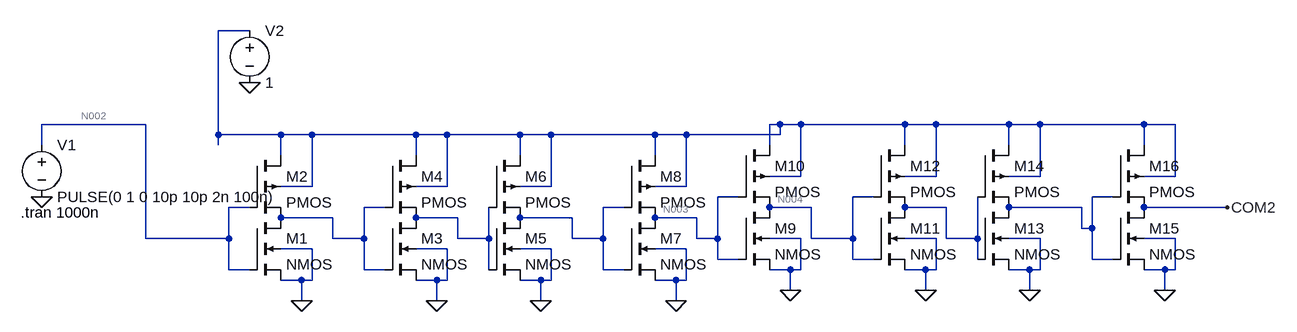
[diagram p0: schematic RingOscillator1.asc]
RingOscillator1.asc, the LTspice schematic file:
Version 4
SHEET 1 1828 680
WIRE 240 -112 192 -112
WIRE 80 32 -80 32
WIRE 1056 32 1040 32
WIRE 1088 32 1056 32
WIRE 1248 32 1088 32
WIRE 1296 32 1248 32
WIRE 1408 32 1296 32
WIRE 1456 32 1408 32
WIRE 1616 32 1456 32
WIRE 1664 32 1616 32
WIRE 192 48 192 -112
WIRE 288 48 192 48
WIRE 336 48 288 48
WIRE 496 48 336 48
WIRE 544 48 496 48
WIRE 656 48 544 48
WIRE 704 48 656 48
WIRE 864 48 704 48
WIRE 912 48 864 48
WIRE 1056 48 1056 32
WIRE 1056 48 912 48
WIRE -80 64 -80 32
WIRE 192 64 192 48
WIRE 1040 64 1040 32
WIRE 1248 64 1248 32
WIRE 1408 64 1408 32
WIRE 1616 64 1616 32
WIRE 288 80 288 48
WIRE 496 80 496 48
WIRE 656 80 656 48
WIRE 864 80 864 48
WIRE 1088 112 1088 32
WIRE 1088 112 1040 112
WIRE 1296 112 1296 32
WIRE 1296 112 1248 112
WIRE 1456 112 1456 32
WIRE 1456 112 1408 112
WIRE 1664 112 1664 32
WIRE 1664 112 1616 112
WIRE 336 128 336 48
WIRE 336 128 288 128
WIRE 544 128 544 48
WIRE 544 128 496 128
WIRE 704 128 704 48
WIRE 704 128 656 128
WIRE 912 128 912 48
WIRE 912 128 864 128
WIRE 992 144 960 144
WIRE 1200 144 1168 144
WIRE 1568 144 1536 144
WIRE 240 160 208 160
WIRE 448 160 416 160
WIRE 816 160 784 160
WIRE 1104 160 1040 160
WIRE 1312 160 1248 160
WIRE 1520 160 1408 160
WIRE 1744 160 1616 160
WIRE 368 176 288 176
WIRE 560 176 496 176
WIRE 736 176 656 176
WIRE 928 176 864 176
WIRE 1520 192 1520 160
WIRE 1536 192 1536 144
WIRE 1536 192 1520 192
WIRE 80 208 80 32
WIRE 208 208 208 160
WIRE 208 208 80 208
WIRE 368 208 368 176
WIRE 416 208 416 160
WIRE 416 208 368 208
WIRE 560 208 560 176
WIRE 608 208 608 160
WIRE 608 208 560 208
WIRE 736 208 736 176
WIRE 784 208 784 160
WIRE 784 208 736 208
WIRE 928 208 928 176
WIRE 960 208 960 144
WIRE 960 208 928 208
WIRE 1088 208 1040 208
WIRE 1104 208 1104 160
WIRE 1168 208 1168 144
WIRE 1168 208 1104 208
WIRE 1296 208 1248 208
WIRE 1312 208 1312 160
WIRE 1360 208 1360 144
WIRE 1360 208 1312 208
WIRE 1456 208 1408 208
WIRE 1664 208 1616 208
WIRE 336 224 288 224
WIRE 544 224 496 224
WIRE 704 224 656 224
WIRE 912 224 864 224
WIRE 960 240 960 208
WIRE 992 240 960 240
WIRE 1168 240 1168 208
WIRE 1200 240 1168 240
WIRE 1360 240 1360 208
WIRE 1536 240 1536 192
WIRE 1568 240 1536 240
WIRE 208 256 208 208
WIRE 240 256 208 256
WIRE 416 256 416 208
WIRE 448 256 416 256
WIRE 608 256 608 208
WIRE 784 256 784 208
WIRE 816 256 784 256
WIRE 1072 256 1040 256
WIRE 1088 256 1088 208
WIRE 1088 256 1072 256
WIRE 1280 256 1248 256
WIRE 1296 256 1296 208
WIRE 1296 256 1280 256
WIRE 1440 256 1408 256
WIRE 1456 256 1456 208
WIRE 1456 256 1440 256
WIRE 1648 256 1616 256
WIRE 1664 256 1664 208
WIRE 1664 256 1648 256
WIRE 320 272 288 272
WIRE 336 272 336 224
WIRE 336 272 320 272
WIRE 528 272 496 272
WIRE 544 272 544 224
WIRE 544 272 528 272
WIRE 688 272 656 272
WIRE 704 272 704 224
WIRE 704 272 688 272
WIRE 896 272 864 272
WIRE 912 272 912 224
WIRE 912 272 896 272
WIRE 1072 288 1072 256
WIRE 1280 288 1280 256
WIRE 1440 288 1440 256
WIRE 1648 288 1648 256
WIRE 320 304 320 272
WIRE 528 304 528 272
WIRE 688 304 688 272
WIRE 896 304 896 272
FLAG -80 144 0
FLAG 240 -32 0
FLAG 1744 160 COM2
FLAG 320 304 0
FLAG 528 304 0
FLAG 688 304 0
FLAG 896 304 0
FLAG 1072 288 0
FLAG 1280 288 0
FLAG 1440 288 0
FLAG 1648 288 0
SYMBOL voltage -80 48 R0
WINDOW 123 0 0 Left 0
WINDOW 39 0 0 Left 0
SYMATTR InstName V1
SYMATTR Value PULSE(0 1 0 10p 10p 2n 100n)
SYMBOL voltage 240 -128 R0
WINDOW 123 0 0 Left 0
WINDOW 39 0 0 Left 0
SYMATTR InstName V2
SYMATTR Value 1
SYMBOL nmos4 240 176 R0
SYMATTR InstName M1
SYMBOL pmos4 240 80 R0
SYMATTR InstName M2
SYMBOL nmos4 448 176 R0
SYMATTR InstName M3
SYMBOL pmos4 448 80 R0
SYMATTR InstName M4
SYMBOL nmos4 608 176 R0
SYMATTR InstName M5
SYMBOL pmos4 608 80 R0
SYMATTR InstName M6
SYMBOL nmos4 816 176 R0
SYMATTR InstName M7
SYMBOL pmos4 816 80 R0
SYMATTR InstName M8
SYMBOL nmos4 992 160 R0
SYMATTR InstName M9
SYMBOL pmos4 992 64 R0
SYMATTR InstName M10
SYMBOL nmos4 1200 160 R0
SYMATTR InstName M11
SYMBOL pmos4 1200 64 R0
SYMATTR InstName M12
SYMBOL nmos4 1360 160 R0
SYMATTR InstName M13
SYMBOL pmos4 1360 64 R0
SYMATTR InstName M14
SYMBOL nmos4 1568 160 R0
SYMATTR InstName M15
SYMBOL pmos4 1568 64 R0
SYMATTR InstName M16
TEXT -112 168 Left 2 !.tran 1000n

The netlist it stands for:
* RingOscillator1.asc
V1 N002 0 PULSE(0 1 0 10p 10p 2n 100n)
V2 N001 0 1
M1 N006 N002 0 0 NMOS
M2 N001 N002 N006 N001 PMOS
M3 N009 N006 0 0 NMOS
M4 N001 N006 N009 N001 PMOS
M5 N007 N009 0 0 NMOS
M6 N001 N009 N007 N001 PMOS
M7 N003 N007 0 0 NMOS
M8 N001 N007 N003 N001 PMOS
M9 N004 N003 0 0 NMOS
M10 N001 N003 N004 N001 PMOS
M11 N008 N004 0 0 NMOS
M12 N001 N004 N008 N001 PMOS
M13 N005 N008 0 0 NMOS
M14 N001 N008 N005 N001 PMOS
M15 COM2 N005 0 0 NMOS
M16 N001 N005 COM2 N001 PMOS
.model NMOS NMOS
.model PMOS PMOS
.lib standard.mos
.tran 1000n
.backanno
.end

* Results of the author's LTspice run, read from the files saved beside the schematic
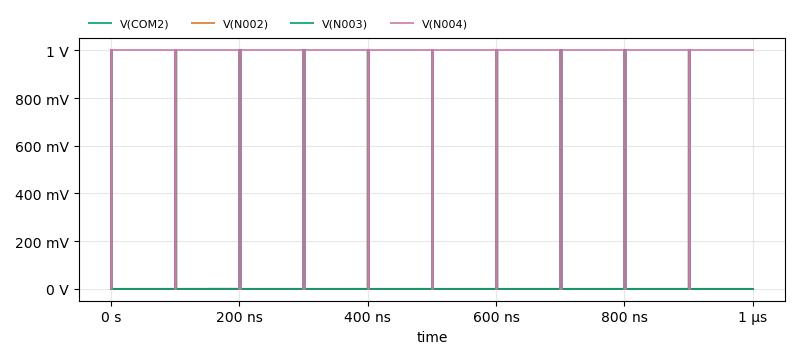
[diagram p1: Transient Analysis of RingOscillator1.asc, plotted from the saved traces]
* Transient Analysis, 1 run:
*   V(COM2): min 0 V, max 1 V, average 20.1 mV, rms 141.8 mV, last 100.5 nV
*   V(N002): min 0 V, max 1 V, average 20.1 mV, rms 141.7 mV, last 0 V
*   V(N003): min 100.5 nV, max 1 V, average 20.1 mV, rms 141.8 mV, last 100.5 nV
*   V(N004): min 100.5 nV, max 1 V, average 979.9 mV, rms 989.9 mV, last 1 V